# Altium project rs485.PrjPCB
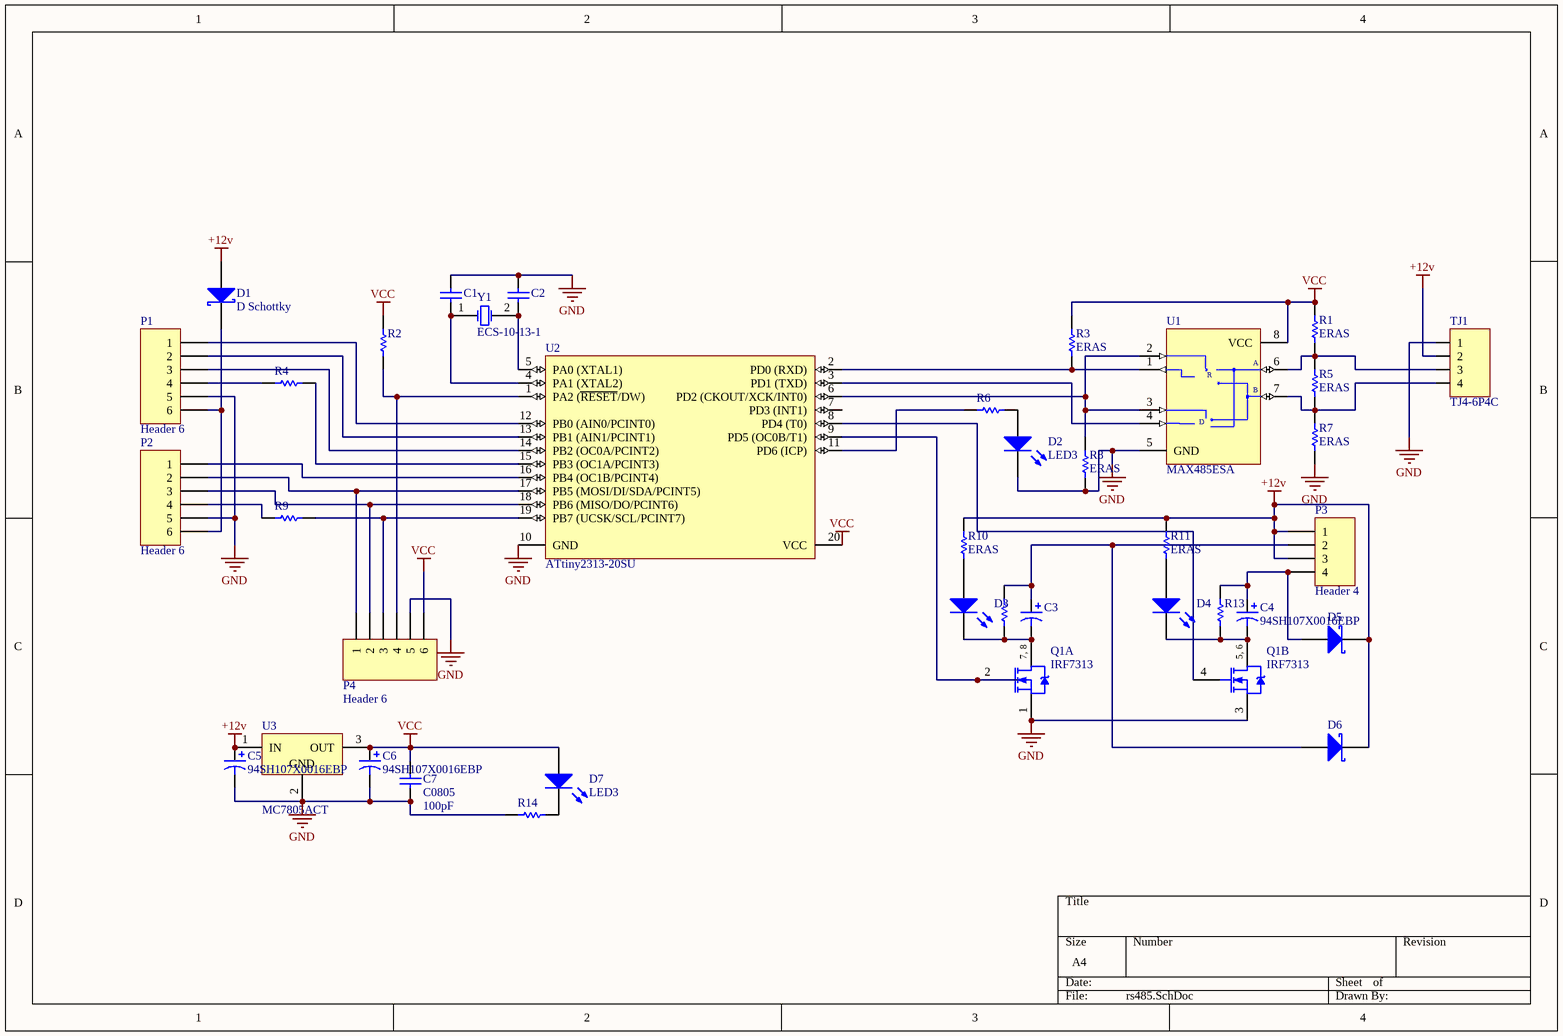
[diagram p0: rs485.SchDoc]
1 sheet, 38 parts. Net scope: global (net labels, ports and power ports of the same name join across sheets).
Board file: rs485.PcbDoc

## Sheet rs485.SchDoc
size A4

### Parts
C1  C0805  [0805]  (value not drawn)
C2  C0805  [0805]  (value not drawn)
C3  94SH107X0016EBP  [E]  (value not drawn)
C4  94SH107X0016EBP  [E]
C5  94SH107X0016EBP  [E]
C6  94SH107X0016EBP  [E]
C7  C0805  value 100pF  [0805]
D1  D Schottky  [SMB]
D2  LED3  [3.5X2.8X1.9]
D3  LED3  [3.5X2.8X1.9]  (value not drawn)
D4  LED3  [3.5X2.8X1.9]  (value not drawn)
D5  D Schottky  [SMB]  (value not drawn)
D6  D Schottky  [SMB]  (value not drawn)
D7  LED3  [3.5X2.8X1.9]
P1  Header 6  [HDR1X6]
P2  Header 6  [HDR1X6]
P3  Header 4  [HDR1X4]
P4  Header 6  [HDR1X6]
Q1  IRF7313  [SO-8_N]  (parts A,B of 2)
R1  ERAS  [ERA-0805]
R2  ERAS  [ERA-0805]  (value not drawn)
R3  ERAS  [ERA-0805]
R4  ERAS  [ERA-0805]  (value not drawn)
R5  ERAS  [ERA-0805]
R6  ERAS  [ERA-0805]  (value not drawn)
R7  ERAS  [ERA-0805]
R8  ERAS  [ERA-0805]
R9  ERAS  [ERA-0805]  (value not drawn)
R10  ERAS  [ERA-0805]
R11  ERAS  [ERA-0805]
R12  ERAS  [ERA-0805]  (value not drawn)
R13  ERAS  [ERA-0805]  (value not drawn)
R14  ERAS  [ERA-0805]  (value not drawn)
TJ1  TJ4-6P4C  [TJ4-6P4C]
U1  MAX485ESA  [NSO8_N]
U2  ATtiny2313-20SU  [20S_N]
U3  MC7805ACT  [221A-06]
Y1  ECS-10-13-1  [HC-49U]

### Nets
+12v: C5.1 D1.1(A) D5.2(K) D6.2(K) P3.1 P3.3 R10.1 R11.1 TJ1.2 U3.1(IN)
GND: C1.1 C2.1 C5.2 C6.2 C7.1 D2.2(K) P1.5 P2.5 P4.5 Q1.1(S) Q1.3(S) R7.2 R8.2 R14.2 TJ1.1 U1.5(GND) U2.10(GND) U3.2(GND)
VCC: C6.1 C7.2 D7.1(A) P4.6 R1.1 R2.1 R3.1 U1.8(VCC) U2.20(VCC) U3.3(OUT)
NetC1_2: C1.2 U2.4(PA1_(XTAL2)) Y1.1(OSC1)
NetC2_2: C2.2 U2.5(PA0_(XTAL1)) Y1.2(OSC2)
NetC3_1: C3.1 D6.1(A) P3.2 R12.1
NetC3_2: C3.2 D3.2(K) Q1.7(D) Q1.8(D) R12.2
NetC4_1: C4.1 D5.1(A) P3.4 R13.1
NetC4_2: C4.2 D4.2(K) Q1.5(D) Q1.6(D) R13.2
NetD1_2: D1.2(K) P1.6 P2.6
NetD2_1: D2.1(A) R6.2
NetD3_1: D3.1(A) R10.2
NetD4_1: D4.1(A) R11.2
NetD7_2: D7.2(K) R14.1
NetP1_1: P1.1 U2.12(PB0_(AIN0/PCINT0))
NetP1_2: P1.2 U2.13(PB1_(AIN1/PCINT1))
NetP1_3: P1.3 U2.14(PB2_(OC0A/PCINT2))
NetP1_4: P1.4 R4.2
NetP2_1: P2.1 U2.16(PB4_(OC1B/PCINT4))
NetP2_2: P2.2 P4.1 U2.17(PB5_(MOSI/DI/SDA/PCINT5))
NetP2_3: P2.3 P4.2 U2.18(PB6_(MISO/DO/PCINT6))
NetP2_4: P2.4 R9.2
NetP4_3: P4.3 R9.1 U2.19(PB7_(UCSK/SCL/PCINT7))
NetP4_4: P4.4 R2.2 U2.1(PA2_(~{RESET}/DW))
NetQ1_2: Q1.2(G) U2.9(PD5_(OC0B/T1))
NetQ1_4: Q1.4(G) U2.8(PD4_(T0))
NetR1_2: R1.2 R5.1 TJ1.3 U1.6(A)
NetR3_2: R3.2 U1.1(RO) U2.2(PD0_(RXD))
NetR4_1: R4.1 U2.15(PB3_(OC1A/PCINT3))
NetR5_2: R5.2 R7.1 TJ1.4 U1.7(B)
NetR6_1: R6.1 U2.11(PD6_(ICP))
NetR8_1: R8.1 U1.2(~{RE}) U1.3(DE) U2.6(PD2_(CKOUT/XCK/INT0))
NetU1_4: U1.4(DI) U2.3(PD1_(TXD))

Not connected (* = marked no-connect by the designer): U2 7(PD3_(INT1))

### Notes on the sheet
- (in symbol IRF7313, part A) 7, 8
- (in symbol IRF7313, part B) 5, 6
- (in symbol MAX485ESA) R; D

### Library data of the parts
C1 C2 = C0805: Ceramic Chip Capacitor - Standard; Note: Footprint corresponds to dimensions for bulk cassette packaging. This case size has tightened tolerances.; Value: 100pF; Published: 17-Jul-2002; LatestRevisionDate: 19-Mar-2004; LatestRevisionNote: Silkscreen size reduced.; DatasheetDocument: Mar-2001; PackageDocument: Mar-2001; PackageReference: 0805; Publisher: Altium Limited; Code_JEITA: 0805; Code_IPC: 2012[0805]; ComponentLink1Description: Manufacturer Link; ComponentLink1URL: http://www.kemet.com/; ComponentLink2Description: Datasheet; ComponentLink2URL: http://www.kemet.com/kemet/web/homepage/kechome.nsf/vapubfilesname/F3102TA.pdf/$file/F3102TA.pdf
C3-C6 = 94SH107X0016EBP: Solid Aluminum Capacitor with Organic Semiconductor Electrolyte: 100uF, 16V, Bulk Pack; Note: Part Numbers shown are for ± 20% capacitance tolerance (X0).; PCB_Layout: Complies with Manufacturer's Recommendation.; DrillSize: Nominal, Rounded to the nearest 0.1mm; Published: 19-Mar-2004; DatasheetDocument: 23-May-2001; PackageReference: E; Publisher: Altium Limited; ComponentLink1Description: Manufacturer Link; ComponentLink1URL: http://www.vishay.com/; ComponentLink2Description: Datasheet; ComponentLink2URL: http://www.vishay.com/docs/90006/94sh.pdf; Value: 100uF
C7 = C0805: Ceramic Chip Capacitor - Standard; Note: Footprint corresponds to dimensions for bulk cassette packaging. This case size has tightened tolerances.; Published: 17-Jul-2002; LatestRevisionDate: 19-Mar-2004; LatestRevisionNote: Silkscreen size reduced.; DatasheetDocument: Mar-2001; PackageDocument: Mar-2001; PackageReference: 0805; Publisher: Altium Limited; Code_JEITA: 0805; Code_IPC: 2012[0805]; ComponentLink1Description: Manufacturer Link; ComponentLink1URL: http://www.kemet.com/; ComponentLink2Description: Datasheet; ComponentLink2URL: http://www.kemet.com/kemet/web/homepage/kechome.nsf/vapubfilesname/F3102TA.pdf/$file/F3102TA.pdf
D1 D5 D6 = D Schottky: Schottky Diode; Published: 8-Jun-2000; LatestRevisionDate: 17-Jul-2002; LatestRevisionNote: Re-released for DXP Platform.; PackageReference: SMB; Publisher: Altium Limited; PackageDescription: DO-214-AA/SMB; 2 C-Bend Leads; Body 5.3 x 3.6 mm, inc. leads (LxW); Code_JEDEC: DO-214-AA
D2-D4 D7 = LED3: Typical BLUE SiC LED; Published: 8-Jun-2000; LatestRevisionDate: 17-Dec-2003; LatestRevisionNote: PCB Footprint replaced.; DatasheetVersion: 16-Apr-2002; PackageVersion: 16-Apr-2002; PackageReference: 3.5X2.8X1.9; Publisher: Altium Limited; PackageDescription: SM LED; 2 C-Bend Leads; Body 3.5 x 2.8 x 1.9 mm, inc leads (LxWxH typ)
P1 P2 P4 = Header 6: Header, 6-Pin; LatestRevisionDate: 17-Jul-2002; LatestRevisionNote: Re-released for DXP Platform.; Publisher: Altium Limited
P3 = Header 4: Header, 4-Pin; LatestRevisionDate: 17-Jul-2002; LatestRevisionNote: Re-released for DXP Platform.; Publisher: Altium Limited
Q1 = IRF7313: HEXFET Power MOSFET; Published: 8-Jun-2000; LatestRevisionDate: 13-Apr-2006; LatestRevisionNote: IPC-7351 Footprint Added.; DatasheetVersion: Aug-1997; PackageVersion: Feb-2001; PackageReference: SO-8; Publisher: Altium Limited; PackageDescription: 8-Pin Plastic Small Outline Integrated Circuit 1.27 mm Pitch; Code_JEDEC: MS-012-AA; Code_IPC: SOIC127P600-8; ComponentLink1Description: Manufacturer Link; ComponentLink1URL: http://www.irf.com/; ComponentLink2Description: Datasheet; ComponentLink2URL: http://www.irf.com/product-info/datasheets/data/irf7313.pdf
R1-R14 = ERAS: Metal Film Thermosensitive Chip Resistor, 0.56 Ohm to 10k Ohm Range, 5% Tolerance, 0805 Size, 0.1 W; Note: If flow soldering, adjust pad width of PCB Footprint to 0.7 - 0.8 times the width of the resistor.; Published: 17-Dec-2003; LatestRevisionDate: 19-Mar-2004; LatestRevisionNote: Silkscreen size reduced.; PackageDocument: Mar-2003; PackageReference: ERA-0805; Publisher: Altium Limited; Code_IPC: 2012 [0805]; ComponentLink1Description: Manufacturer Link; ComponentLink1URL: http://www.panasonic.com/industrial/components/resistive_products.htm; ComponentLink2Description: Datasheet; ComponentLink2URL: http://www.panasonic.com/industrial/components/pdf/AOF0000CE1.pdf
U1 = MAX485ESA: Low-Power, Slew-Rate-Limited RS-485/RS-422 Transceiver; Published: 16-Jan-2001; LatestRevisionDate: 13-Apr-2006; LatestRevisionNote: IPC-7351 Footprint Added.; DatasheetVersion: Feb-1996; PackageReference: NSO8; Publisher: Altium Limited; PackageDescription: 8-Pin Small Outline Integrated Circuit 1.27 mm Pitch; Code_JEDEC: MS-012-AA; Code_IPC: SOIC127P600-8; ComponentLink1Description: Manufacturer Link; ComponentLink1URL: http://www.maxim-ic.com/; ComponentLink2Description: Datasheet; ComponentLink2URL: http://pdfserv.maxim-ic.com/en/ds/MAX1487-MAX491.pdf
U2 = ATtiny2313-20SU: Low Power tinyAVR® 8-Bit Microcontroller, 2K Flash Memory, 20MHz, Industrial Temperature, 20-Lead SOIC, Pb-Free; Published: 20-Nov-2009; DatasheetVersion: DOC2543B, Mar-2009; PackageVersion: revA, Jan-2002; PackageReference: 20S; Publisher: Altium Limited; PackageDescription: 20-lead, 0.300" Wide Body, Plastic Gull Wing Small Outline Package (SOIC); Supplier 1: Digi-Key; Supplier Part Number 1: ATTINY2313-20SU-ND; Supplier 2: Farnell; Supplier Part Number 2: 1661731; Supplier 3: Farnell; Supplier Part Number 3: 9171606; Supplier 4: Mouser; Supplier Part Number 4: 556-ATTINY2313-20SU; Code_JEDEC: MS-013-AC; Code_IPC: SOIC127P1030-20; ComponentLink1Description: Manufacturer Link; ComponentLink1URL: http://www.atmel.com/products/AVR/tinyavr.asp?; ComponentLink2Description: Datasheet; ComponentLink2URL: http://www.atmel.com/dyn/resources/prod_documents/doc2543.pdf; ComponentLink3Description: Atmel.com Home; ComponentLink3URL: http://www.atmel.com
U3 = MC7805ACT: Three-Terminal Positive Voltage Regulator; Note: Heatsink surface is connected to Pin 2; Published: 15-Apr-2002; DatasheetVersion: 1997; PackageVersion: 1997; PackageReference: 221A-06; Publisher: Altium Limited; PackageDescription: TO, Thru-Hole, Vertical, Heatsink Mounted; 3 In-Line Leads; Pitch 2.54 mm; Code_JEDEC: TO-262-AA; ComponentLink1Description: Manufacturer Link; ComponentLink1URL: http://www.onsemi.com/site/products/taxonomy/0,4438,503,00.html; ComponentLink2Description: Datasheet; ComponentLink2URL: http://www.onsemi.com/pub/Collateral/MC7800-D.PDF
Y1 = ECS-10-13-1: Crystal Oscillator; Published: 17-Jul-2002; DatasheetDocument: 18-Apr-2000; PackageReference: HC-49U; Publisher: Altium Limited; ComponentLink1Description: Manufacturer Link; ComponentLink1URL: http://www.ecsxtal.com/; ComponentLink2Description: Datasheet; ComponentLink2URL: http://www.ecsxtal.com/pdf2/HC49U.PDF